# Altium schematic sheet USB.SchDoc
size A; SheetNumber: 4; SheetTotal: 9
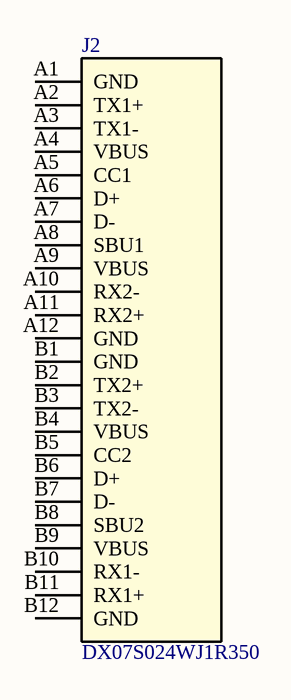
[diagram p0: USB.SchDoc]

## Parts
J2  DX07S024WJ1R350  [DX07S024WJ1R350-Footprint-1]

## Nets

Not connected (* = marked no-connect by the designer): J2 A1(GND) A2(TX1+) A3(TX1-) A4(VBUS) A5(CC1) A6(D+) A7(D-) A8(SBU1) A9(VBUS) A10(RX2-) A11(RX2+) A12(GND) B1(GND) B2(TX2+) B3(TX2-) B4(VBUS) B5(CC2) B6(D+) B7(D-) B8(SBU2) B9(VBUS) B10(RX1-) B11(RX1+) B12(GND)

## Library data of the parts
J2 = CMP-002-00075-3: Vertical Mount Type C receptacle; 12mm Height